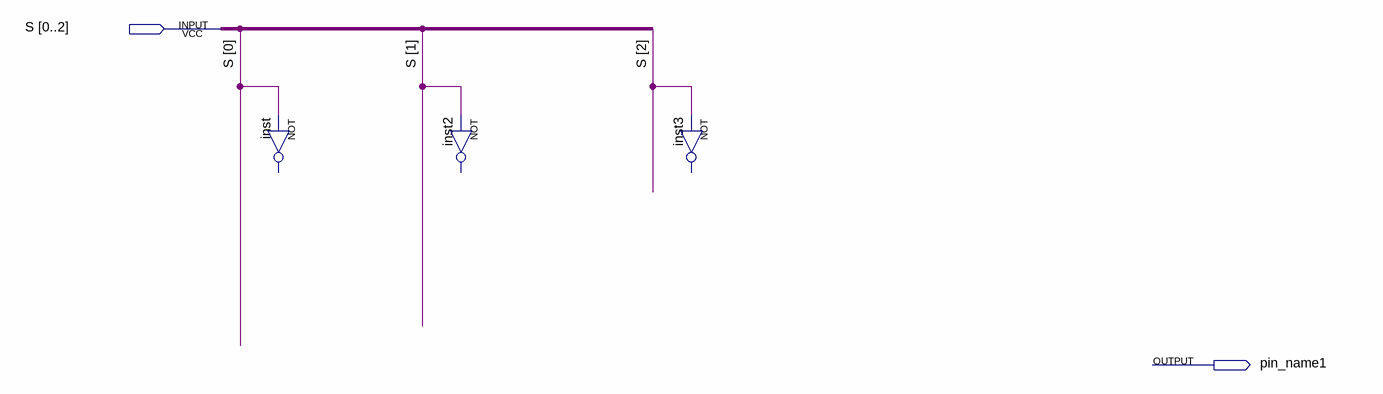
[diagram p0: schematic sheet]
// Quartus schematic main.bdf as structural Verilog: 3 symbols, 2 pins
module main (
  input  [0:2] S,
  output pin_name1
);

  // NOT inst has open pins: IN=S[0], OUT=open
  // NOT inst2 has open pins: IN=S[1], OUT=open
  // NOT inst3 has open pins: IN=S[2], OUT=open
endmodule
